# Altium schematic sheet ConectoresSalida.SchDoc
size 533 x 304 mm
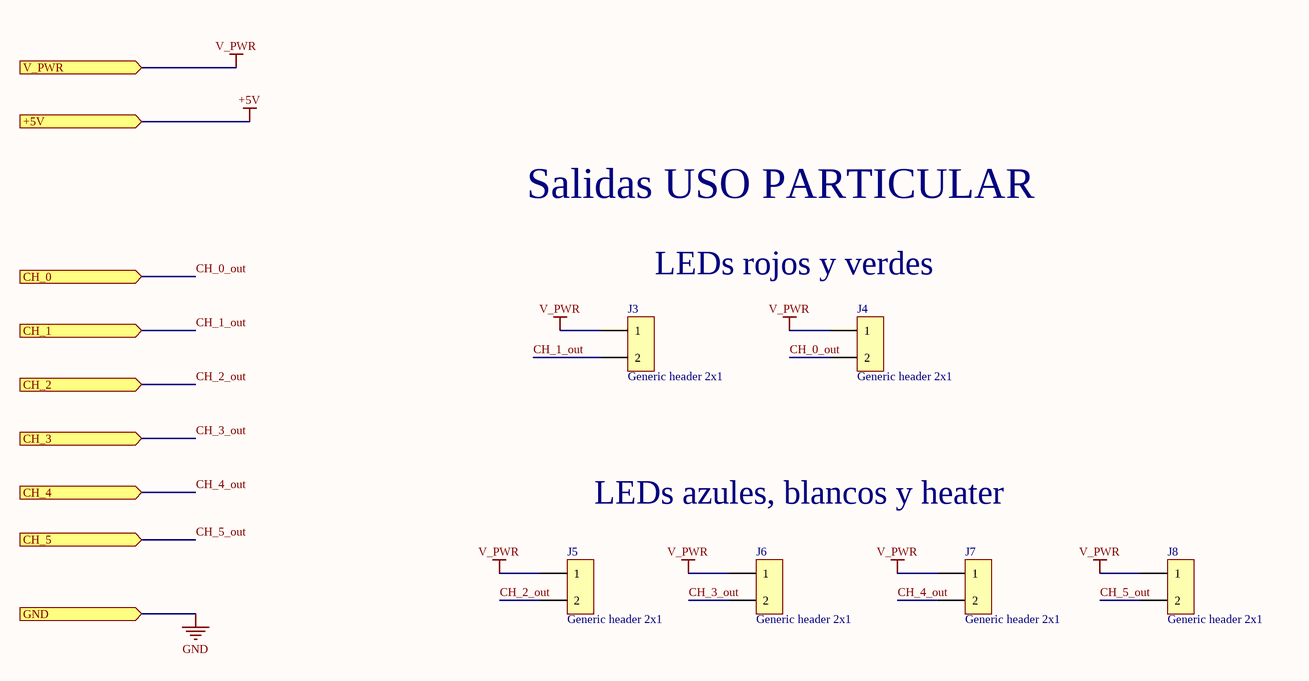
[diagram p0: ConectoresSalida.SchDoc]

## Parts
J3  Generic header 2x1  [JST-2x1]
J4  Generic header 2x1  [JST-2x1]
J5  Generic header 2x1  [JST-2x1]
J6  Generic header 2x1  [JST-2x1]
J7  Generic header 2x1  [JST-2x1]
J8  Generic header 2x1  [JST-2x1]

## Ports
+5V (in), CH_0 (in), CH_1 (in), CH_2 (in), CH_3 (in), CH_4 (in), CH_5 (in), GND (in), V_PWR (in)

## Nets
+5V: port +5V
GND: port GND
V_PWR: J3.1 J4.1 J5.1 J6.1 J7.1 J8.1 ; port V_PWR
CH_0_out: J4.2 ; port CH_0
CH_1_out: J3.2 ; port CH_1
CH_2_out: J5.2 ; port CH_2
CH_3_out: J6.2 ; port CH_3
CH_4_out: J7.2 ; port CH_4
CH_5_out: J8.2 ; port CH_5

## Notes on the sheet
- Salidas USO PARTICULAR
- LEDs rojos y verdes
- LEDs azules, blancos y heater

## Library data of the parts
J3-J8 = Header - 2x1: Generic Header 2pos, 1 row, 2.54 pitch; Manufacturer: CJT(Changjiang Connectors); Manufacturer Part Number: A2547WV-2P; Pitch: 2.54mm; Description: 2 Header XH 0.098"(2.50mm) Male Pin Through Hole Wire To Board / Wire To Wire Connector ROHS; Supplier 1: LCSC; Supplier Part Number 1: C20079; Package: Through Hole,P=2.54mm